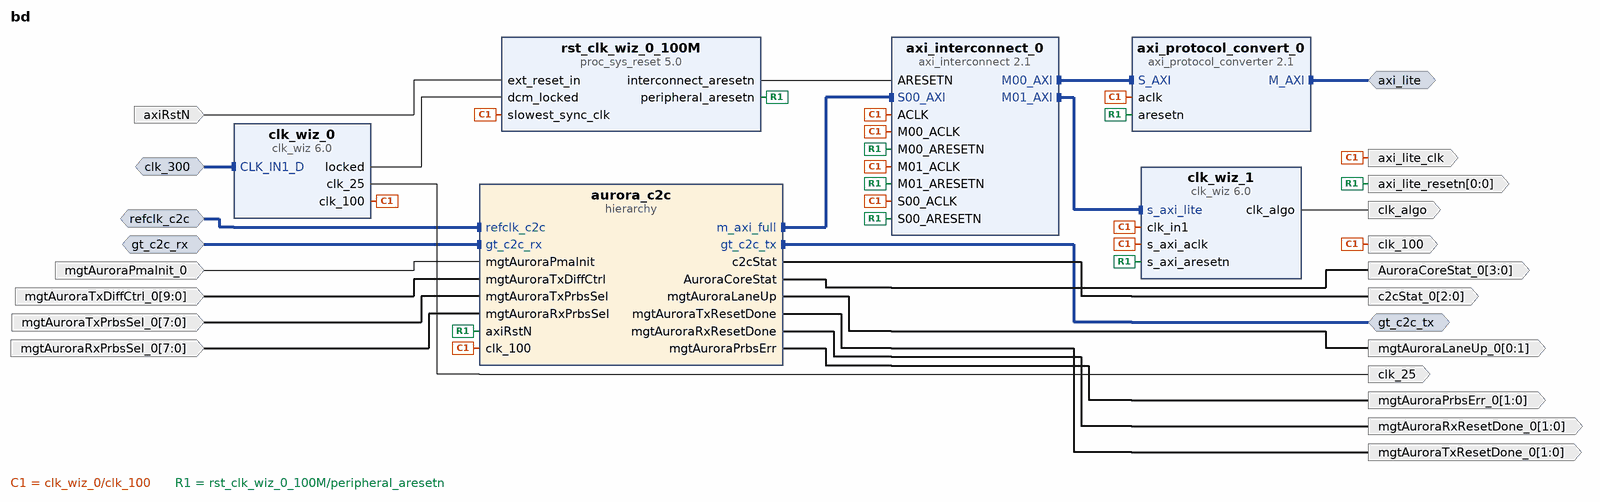
[diagram p0: block diagram of the top level]
# Vivado block design bd, xcvu9p-flgc2104-1-e, Vivado 2018.2
create_bd_design bd

create_bd_intf_port -mode Slave -vlnv xilinx.com:interface:diff_clock_rtl:1.0 refclk_c2c
set_property -dict {CONFIG.FREQ_HZ 100000000} [get_bd_intf_ports refclk_c2c]
create_bd_intf_port -mode Slave -vlnv xilinx.com:interface:diff_clock_rtl:1.0 clk_300
set_property -dict {CONFIG.FREQ_HZ 300000000} [get_bd_intf_ports clk_300]
create_bd_intf_port -mode Slave -vlnv xilinx.com:display_aurora:GT_Serial_Transceiver_Pins_RX_rtl:1.0 gt_c2c_rx
create_bd_intf_port -mode Master -vlnv xilinx.com:display_aurora:GT_Serial_Transceiver_Pins_TX_rtl:1.0 gt_c2c_tx
create_bd_intf_port -mode Master -vlnv xilinx.com:interface:aximm_rtl:1.0 axi_lite
set_property -dict [list \
  CONFIG.DATA_WIDTH 32 \
  CONFIG.PROTOCOL AXI4LITE \
  CONFIG.ADDR_WIDTH 32 \
  CONFIG.HAS_BURST 0 \
  CONFIG.HAS_LOCK 0 \
  CONFIG.HAS_CACHE 0 \
  CONFIG.HAS_QOS 0 \
  CONFIG.HAS_REGION 0 \
] [get_bd_intf_ports axi_lite]
create_bd_port -dir O -type clk clk_100
create_bd_port -dir O -type clk axi_lite_clk
create_bd_port -dir O -from 0 -to 0 -type rst axi_lite_resetn
create_bd_port -dir I -type rst axiRstN
create_bd_port -dir I -type rst mgtAuroraPmaInit_0
set_property -dict {CONFIG.POLARITY ACTIVE_HIGH} [get_bd_ports mgtAuroraPmaInit_0]
create_bd_port -dir I -from 9 -to 0 mgtAuroraTxDiffCtrl_0
create_bd_port -dir I -from 7 -to 0 mgtAuroraTxPrbsSel_0
create_bd_port -dir I -from 7 -to 0 mgtAuroraRxPrbsSel_0
create_bd_port -dir O -from 2 -to 0 c2cStat_0
create_bd_port -dir O -from 3 -to 0 AuroraCoreStat_0
create_bd_port -dir O -from 0 -to 1 mgtAuroraLaneUp_0
create_bd_port -dir O -from 1 -to 0 mgtAuroraTxResetDone_0
create_bd_port -dir O -from 1 -to 0 mgtAuroraRxResetDone_0
create_bd_port -dir O -from 1 -to 0 mgtAuroraPrbsErr_0
create_bd_port -dir O -type clk clk_25
set_property -dict {CONFIG.FREQ_HZ 25000000} [get_bd_ports clk_25]
create_bd_port -dir O -type clk clk_algo
set_property -dict {CONFIG.FREQ_HZ 10000000} [get_bd_ports clk_algo]

create_bd_cell -type ip -vlnv xilinx.com:ip:clk_wiz:6.0 clk_wiz_0
set_property -dict [list \
  CONFIG.ENABLE_CLOCK_MONITOR false \
  CONFIG.PRIMITIVE MMCM \
  CONFIG.CLKOUT2_USED true \
  CONFIG.CLKOUT3_USED false \
  CONFIG.NUM_OUT_CLKS 2 \
  CONFIG.CLK_OUT1_PORT clk_100 \
  CONFIG.CLK_OUT2_PORT clk_25 \
  CONFIG.CLK_OUT3_PORT clk_out3 \
  CONFIG.CLKOUT2_REQUESTED_OUT_FREQ 25 \
  CONFIG.CLKOUT3_REQUESTED_OUT_FREQ 100.000 \
  CONFIG.PRIM_SOURCE Differential_clock_capable_pin \
  CONFIG.CLKOUT1_DRIVES BUFGCE \
  CONFIG.CLKOUT2_DRIVES BUFGCE \
  CONFIG.CLKOUT3_DRIVES BUFGCE \
  CONFIG.CLKOUT4_DRIVES BUFGCE \
  CONFIG.CLKOUT5_DRIVES BUFGCE \
  CONFIG.CLKOUT6_DRIVES BUFGCE \
  CONFIG.CLKOUT7_DRIVES BUFGCE \
  CONFIG.FEEDBACK_SOURCE FDBK_AUTO \
  CONFIG.USE_LOCKED true \
  CONFIG.USE_RESET false \
  CONFIG.MMCM_DIVCLK_DIVIDE 1 \
  CONFIG.MMCM_CLKOUT1_DIVIDE 48 \
  CONFIG.MMCM_CLKOUT2_DIVIDE 1 \
  CONFIG.USE_SAFE_CLOCK_STARTUP true \
  CONFIG.CLKOUT2_JITTER 133.817 \
  CONFIG.CLKOUT2_PHASE_ERROR 77.836 \
  CONFIG.CLKOUT3_JITTER 81.814 \
  CONFIG.CLKOUT3_PHASE_ERROR 77.836 \
] [get_bd_cells clk_wiz_0]
create_bd_cell -type hier aurora_c2c
create_bd_cell -type ip -vlnv xilinx.com:ip:axi_interconnect:2.1 axi_interconnect_0
set_property -dict {CONFIG.NUM_MI 2 CONFIG.ENABLE_ADVANCED_OPTIONS 1} [get_bd_cells axi_interconnect_0]
create_bd_cell -type ip -vlnv xilinx.com:ip:proc_sys_reset:5.0 rst_clk_wiz_0_100M
create_bd_cell -type ip -vlnv xilinx.com:ip:axi_protocol_converter:2.1 axi_protocol_convert_0
create_bd_cell -type ip -vlnv xilinx.com:ip:clk_wiz:6.0 clk_wiz_1
set_property -dict [list \
  CONFIG.ENABLE_CLOCK_MONITOR false \
  CONFIG.PRIMITIVE MMCM \
  CONFIG.USE_DYN_RECONFIG true \
  CONFIG.CLK_OUT1_PORT clk_algo \
  CONFIG.CLKOUT1_REQUESTED_OUT_FREQ 10.000 \
  CONFIG.MMCM_DIVCLK_DIVIDE 10 \
  CONFIG.MMCM_CLKFBOUT_MULT_F 92.375 \
  CONFIG.MMCM_CLKOUT0_DIVIDE_F 92.375 \
  CONFIG.CLKOUT1_JITTER 460.700 \
  CONFIG.CLKOUT1_PHASE_ERROR 523.418 \
  CONFIG.AXI_DRP true \
] [get_bd_cells clk_wiz_1]

# ---- hierarchy /aurora_c2c ----
current_bd_instance /aurora_c2c
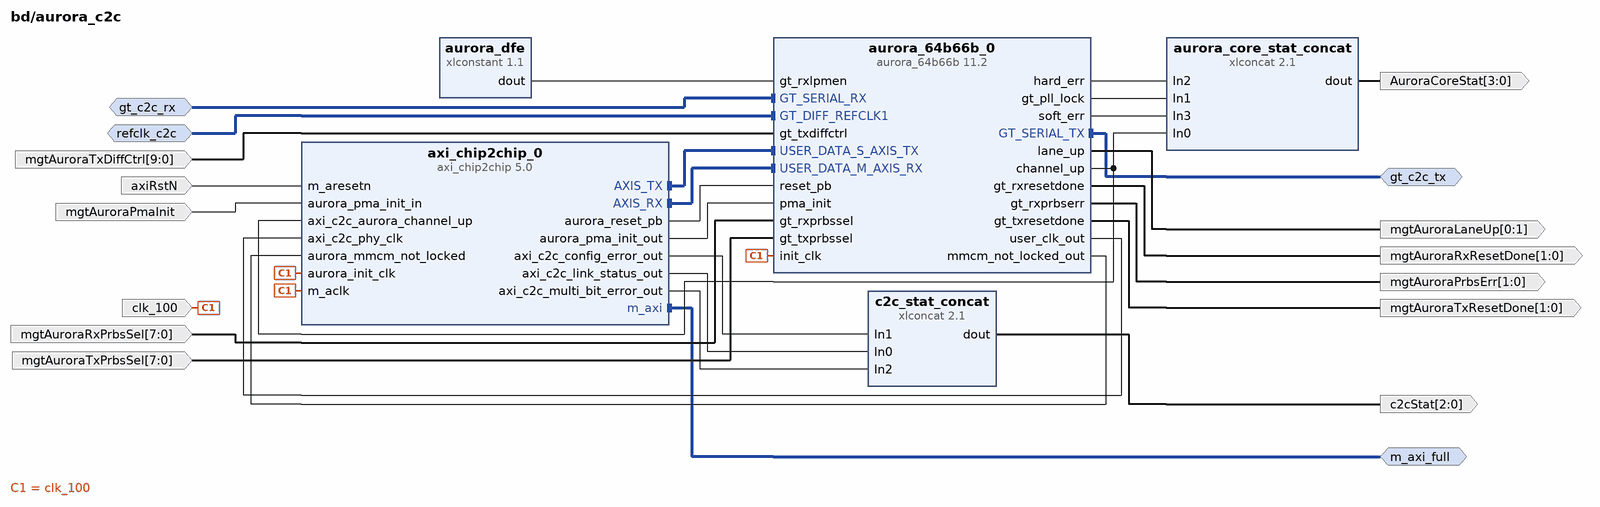
[diagram p1: block diagram inside /aurora_c2c]
create_bd_intf_pin -mode Slave -vlnv xilinx.com:display_aurora:GT_Serial_Transceiver_Pins_RX_rtl:1.0 gt_c2c_rx
create_bd_intf_pin -mode Slave -vlnv xilinx.com:interface:diff_clock_rtl:1.0 refclk_c2c
create_bd_intf_pin -mode Master -vlnv xilinx.com:display_aurora:GT_Serial_Transceiver_Pins_TX_rtl:1.0 gt_c2c_tx
create_bd_intf_pin -mode Master -vlnv xilinx.com:interface:aximm_rtl:1.0 m_axi_full
create_bd_pin -dir I -type rst axiRstN
create_bd_pin -dir I -type clk clk_100
create_bd_pin -dir I -type rst mgtAuroraPmaInit
create_bd_pin -dir O -from 2 -to 0 c2cStat
create_bd_pin -dir O -from 3 -to 0 AuroraCoreStat
create_bd_pin -dir O -from 0 -to 1 mgtAuroraLaneUp
create_bd_pin -dir O -from 1 -to 0 mgtAuroraTxResetDone
create_bd_pin -dir O -from 1 -to 0 mgtAuroraRxResetDone
create_bd_pin -dir O -from 1 -to 0 mgtAuroraPrbsErr
create_bd_pin -dir I -from 9 -to 0 mgtAuroraTxDiffCtrl
create_bd_pin -dir I -from 7 -to 0 mgtAuroraTxPrbsSel
create_bd_pin -dir I -from 7 -to 0 mgtAuroraRxPrbsSel

create_bd_cell -type ip -vlnv xilinx.com:ip:axi_chip2chip:5.0 axi_chip2chip_0
set_property -dict [list \
  CONFIG.C_AXI_STB_WIDTH 8 \
  CONFIG.C_M_AXI_WUSER_WIDTH 0 \
  CONFIG.C_M_AXI_ID_WIDTH 0 \
  CONFIG.C_AXI_DATA_WIDTH 64 \
  CONFIG.C_INCLUDE_AXILITE 0 \
  CONFIG.C_INTERFACE_MODE 0 \
  CONFIG.C_INTERFACE_TYPE 2 \
  CONFIG.C_MASTER_FPGA 0 \
  CONFIG.C_EN_AXI_LINK_HNDLR true \
] [get_bd_cells axi_chip2chip_0]
create_bd_cell -type ip -vlnv xilinx.com:ip:aurora_64b66b:11.2 aurora_64b66b_0
set_property -dict [list \
  CONFIG.CHANNEL_ENABLE {X0Y28 X0Y29} \
  CONFIG.C_AURORA_LANES 2 \
  CONFIG.C_LINE_RATE 10 \
  CONFIG.C_REFCLK_FREQUENCY 100 \
  CONFIG.C_INIT_CLK 100 \
  CONFIG.interface_mode Streaming \
  CONFIG.C_UCOLUMN_USED left \
  CONFIG.C_USE_CHIPSCOPE false \
  CONFIG.C_START_QUAD Quad_X0Y7 \
  CONFIG.C_START_LANE X0Y28 \
  CONFIG.C_REFCLK_SOURCE MGTREFCLK0_of_Quad_X0Y7 \
  CONFIG.drp_mode Disabled \
  CONFIG.SupportLevel 1 \
  CONFIG.TransceiverControl true \
] [get_bd_cells aurora_64b66b_0]
create_bd_cell -type ip -vlnv xilinx.com:ip:xlconstant:1.1 aurora_dfe
set_property -dict {CONFIG.CONST_WIDTH 2 CONFIG.CONST_VAL 0} [get_bd_cells aurora_dfe]
create_bd_cell -type ip -vlnv xilinx.com:ip:xlconcat:2.1 c2c_stat_concat
set_property -dict {CONFIG.NUM_PORTS 3} [get_bd_cells c2c_stat_concat]
create_bd_cell -type ip -vlnv xilinx.com:ip:xlconcat:2.1 aurora_core_stat_concat
set_property -dict {CONFIG.NUM_PORTS 4} [get_bd_cells aurora_core_stat_concat]

# ---- connections ----

current_bd_instance /aurora_c2c
connect_bd_intf_net [get_bd_intf_pins axi_chip2chip_0/AXIS_TX] [get_bd_intf_pins aurora_64b66b_0/USER_DATA_S_AXIS_TX]
connect_bd_intf_net [get_bd_intf_pins axi_chip2chip_0/AXIS_RX] [get_bd_intf_pins aurora_64b66b_0/USER_DATA_M_AXIS_RX]
connect_bd_intf_net [get_bd_intf_pins gt_c2c_rx] [get_bd_intf_pins aurora_64b66b_0/GT_SERIAL_RX]
connect_bd_intf_net [get_bd_intf_pins refclk_c2c] [get_bd_intf_pins aurora_64b66b_0/GT_DIFF_REFCLK1]
connect_bd_intf_net [get_bd_intf_pins gt_c2c_tx] [get_bd_intf_pins aurora_64b66b_0/GT_SERIAL_TX]
connect_bd_intf_net [get_bd_intf_pins m_axi_full] [get_bd_intf_pins axi_chip2chip_0/m_axi]
connect_bd_net [get_bd_pins aurora_64b66b_0/user_clk_out] [get_bd_pins axi_chip2chip_0/axi_c2c_phy_clk]
connect_bd_net [get_bd_pins axi_chip2chip_0/aurora_reset_pb] [get_bd_pins aurora_64b66b_0/reset_pb]
connect_bd_net [get_bd_pins aurora_64b66b_0/mmcm_not_locked_out] [get_bd_pins axi_chip2chip_0/aurora_mmcm_not_locked]
connect_bd_net [get_bd_pins axi_chip2chip_0/aurora_pma_init_out] [get_bd_pins aurora_64b66b_0/pma_init]
connect_bd_net [get_bd_pins aurora_64b66b_0/channel_up] \
  [get_bd_pins axi_chip2chip_0/axi_c2c_aurora_channel_up] [get_bd_pins aurora_core_stat_concat/In0]
connect_bd_net -net aurora_init_clk_1 [get_bd_pins clk_100] \
  [get_bd_pins axi_chip2chip_0/aurora_init_clk] [get_bd_pins aurora_64b66b_0/init_clk] [get_bd_pins axi_chip2chip_0/m_aclk]
connect_bd_net [get_bd_pins axi_chip2chip_0/axi_c2c_config_error_out] [get_bd_pins c2c_stat_concat/In1]
connect_bd_net [get_bd_pins axi_chip2chip_0/axi_c2c_link_status_out] [get_bd_pins c2c_stat_concat/In0]
connect_bd_net [get_bd_pins axi_chip2chip_0/axi_c2c_multi_bit_error_out] [get_bd_pins c2c_stat_concat/In2]
connect_bd_net [get_bd_pins aurora_64b66b_0/hard_err] [get_bd_pins aurora_core_stat_concat/In2]
connect_bd_net [get_bd_pins aurora_64b66b_0/gt_pll_lock] [get_bd_pins aurora_core_stat_concat/In1]
connect_bd_net [get_bd_pins aurora_64b66b_0/lane_up] [get_bd_pins mgtAuroraLaneUp]
connect_bd_net [get_bd_pins aurora_64b66b_0/gt_rxresetdone] [get_bd_pins mgtAuroraRxResetDone]
connect_bd_net [get_bd_pins aurora_64b66b_0/gt_txresetdone] [get_bd_pins mgtAuroraTxResetDone]
connect_bd_net [get_bd_pins aurora_64b66b_0/gt_rxprbserr] [get_bd_pins mgtAuroraPrbsErr]
connect_bd_net -net xlconstant_0_dout [get_bd_pins aurora_dfe/dout] [get_bd_pins aurora_64b66b_0/gt_rxlpmen]
connect_bd_net [get_bd_pins axiRstN] [get_bd_pins axi_chip2chip_0/m_aresetn]
connect_bd_net -net axiRstN1_1 [get_bd_pins mgtAuroraPmaInit] [get_bd_pins axi_chip2chip_0/aurora_pma_init_in]
connect_bd_net [get_bd_pins c2c_stat_concat/dout] [get_bd_pins c2cStat]
connect_bd_net [get_bd_pins aurora_64b66b_0/soft_err] [get_bd_pins aurora_core_stat_concat/In3]
connect_bd_net [get_bd_pins aurora_core_stat_concat/dout] [get_bd_pins AuroraCoreStat]
connect_bd_net [get_bd_pins mgtAuroraTxDiffCtrl] [get_bd_pins aurora_64b66b_0/gt_txdiffctrl]
connect_bd_net [get_bd_pins mgtAuroraRxPrbsSel] [get_bd_pins aurora_64b66b_0/gt_rxprbssel]
connect_bd_net [get_bd_pins mgtAuroraTxPrbsSel] [get_bd_pins aurora_64b66b_0/gt_txprbssel]

current_bd_instance /
connect_bd_intf_net [get_bd_intf_pins axi_interconnect_0/S00_AXI] [get_bd_intf_pins aurora_c2c/m_axi_full]
connect_bd_intf_net [get_bd_intf_pins axi_interconnect_0/M00_AXI] [get_bd_intf_pins axi_protocol_convert_0/S_AXI]
connect_bd_intf_net [get_bd_intf_pins axi_interconnect_0/M01_AXI] [get_bd_intf_pins clk_wiz_1/s_axi_lite]
connect_bd_intf_net [get_bd_intf_ports refclk_c2c] [get_bd_intf_pins aurora_c2c/refclk_c2c]
connect_bd_intf_net -intf_net CLK_IN1_D_0_1 [get_bd_intf_ports clk_300] [get_bd_intf_pins clk_wiz_0/CLK_IN1_D]
connect_bd_intf_net [get_bd_intf_ports gt_c2c_rx] [get_bd_intf_pins aurora_c2c/gt_c2c_rx]
connect_bd_intf_net [get_bd_intf_ports gt_c2c_tx] [get_bd_intf_pins aurora_c2c/gt_c2c_tx]
connect_bd_intf_net [get_bd_intf_ports axi_lite] [get_bd_intf_pins axi_protocol_convert_0/M_AXI]
connect_bd_net [get_bd_pins clk_wiz_0/locked] [get_bd_pins rst_clk_wiz_0_100M/dcm_locked]
connect_bd_net [get_bd_pins clk_wiz_0/clk_100] \
  [get_bd_ports axi_lite_clk] [get_bd_ports clk_100] [get_bd_pins rst_clk_wiz_0_100M/slowest_sync_clk] \
  [get_bd_pins axi_protocol_convert_0/aclk] [get_bd_pins clk_wiz_1/s_axi_aclk] [get_bd_pins clk_wiz_1/clk_in1] \
  [get_bd_pins axi_interconnect_0/ACLK] [get_bd_pins axi_interconnect_0/S00_ACLK] [get_bd_pins axi_interconnect_0/M00_ACLK] \
  [get_bd_pins aurora_c2c/clk_100] [get_bd_pins axi_interconnect_0/M01_ACLK]
connect_bd_net [get_bd_pins rst_clk_wiz_0_100M/interconnect_aresetn] [get_bd_pins axi_interconnect_0/ARESETN]
connect_bd_net [get_bd_pins rst_clk_wiz_0_100M/peripheral_aresetn] \
  [get_bd_ports axi_lite_resetn] [get_bd_pins axi_protocol_convert_0/aresetn] [get_bd_pins clk_wiz_1/s_axi_aresetn] \
  [get_bd_pins axi_interconnect_0/S00_ARESETN] [get_bd_pins aurora_c2c/axiRstN] [get_bd_pins axi_interconnect_0/M00_ARESETN] \
  [get_bd_pins axi_interconnect_0/M01_ARESETN]
connect_bd_net -net ext_reset_in_0_1 [get_bd_ports axiRstN] [get_bd_pins rst_clk_wiz_0_100M/ext_reset_in]
connect_bd_net -net mgtAuroraPmaInit_0_1 [get_bd_ports mgtAuroraPmaInit_0] [get_bd_pins aurora_c2c/mgtAuroraPmaInit]
connect_bd_net -net mgtAuroraTxDiffCtrl_0_1 [get_bd_ports mgtAuroraTxDiffCtrl_0] [get_bd_pins aurora_c2c/mgtAuroraTxDiffCtrl]
connect_bd_net -net mgtAuroraTxPrbsSel_0_1 [get_bd_ports mgtAuroraTxPrbsSel_0] [get_bd_pins aurora_c2c/mgtAuroraTxPrbsSel]
connect_bd_net -net mgtAuroraRxPrbsSel_0_1 [get_bd_ports mgtAuroraRxPrbsSel_0] [get_bd_pins aurora_c2c/mgtAuroraRxPrbsSel]
connect_bd_net [get_bd_pins aurora_c2c/c2cStat] [get_bd_ports c2cStat_0]
connect_bd_net [get_bd_pins aurora_c2c/AuroraCoreStat] [get_bd_ports AuroraCoreStat_0]
connect_bd_net [get_bd_pins aurora_c2c/mgtAuroraLaneUp] [get_bd_ports mgtAuroraLaneUp_0]
connect_bd_net [get_bd_pins aurora_c2c/mgtAuroraTxResetDone] [get_bd_ports mgtAuroraTxResetDone_0]
connect_bd_net [get_bd_pins aurora_c2c/mgtAuroraRxResetDone] [get_bd_ports mgtAuroraRxResetDone_0]
connect_bd_net [get_bd_pins aurora_c2c/mgtAuroraPrbsErr] [get_bd_ports mgtAuroraPrbsErr_0]
connect_bd_net [get_bd_pins clk_wiz_0/clk_25] [get_bd_ports clk_25]
connect_bd_net [get_bd_pins clk_wiz_1/clk_algo] [get_bd_ports clk_algo]

# ---- address map ----
assign_bd_address -offset 0x62000000 -range 64K -target_address_space [get_bd_addr_spaces aurora_c2c/axi_chip2chip_0/MAXI] [get_bd_addr_segs clk_wiz_1/s_axi_lite/Reg]
assign_bd_address -offset 0x68000000 -range 1M -target_address_space [get_bd_addr_spaces aurora_c2c/axi_chip2chip_0/MAXI] [get_bd_addr_segs axi_lite/Reg]

validate_bd_design
save_bd_design
